# EAGLE board MOSFET_Board (EAGLE 9.3.0)
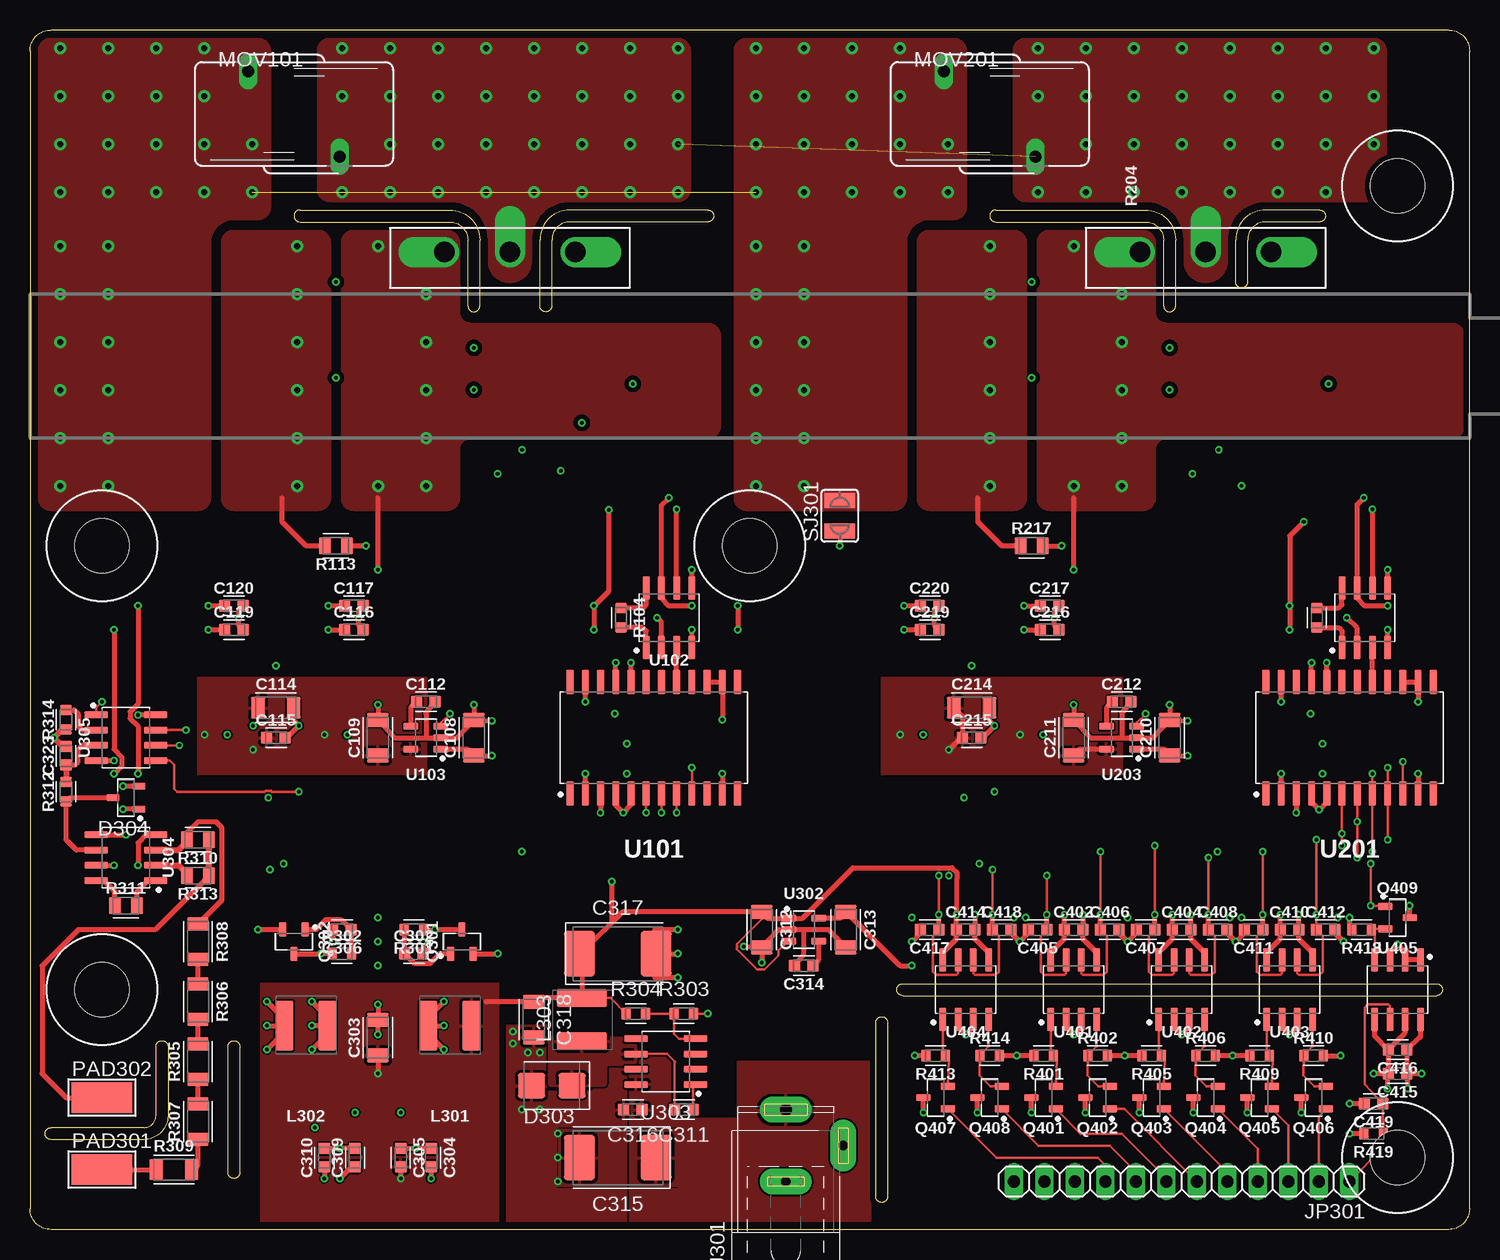
[diagram p4: board, top side]
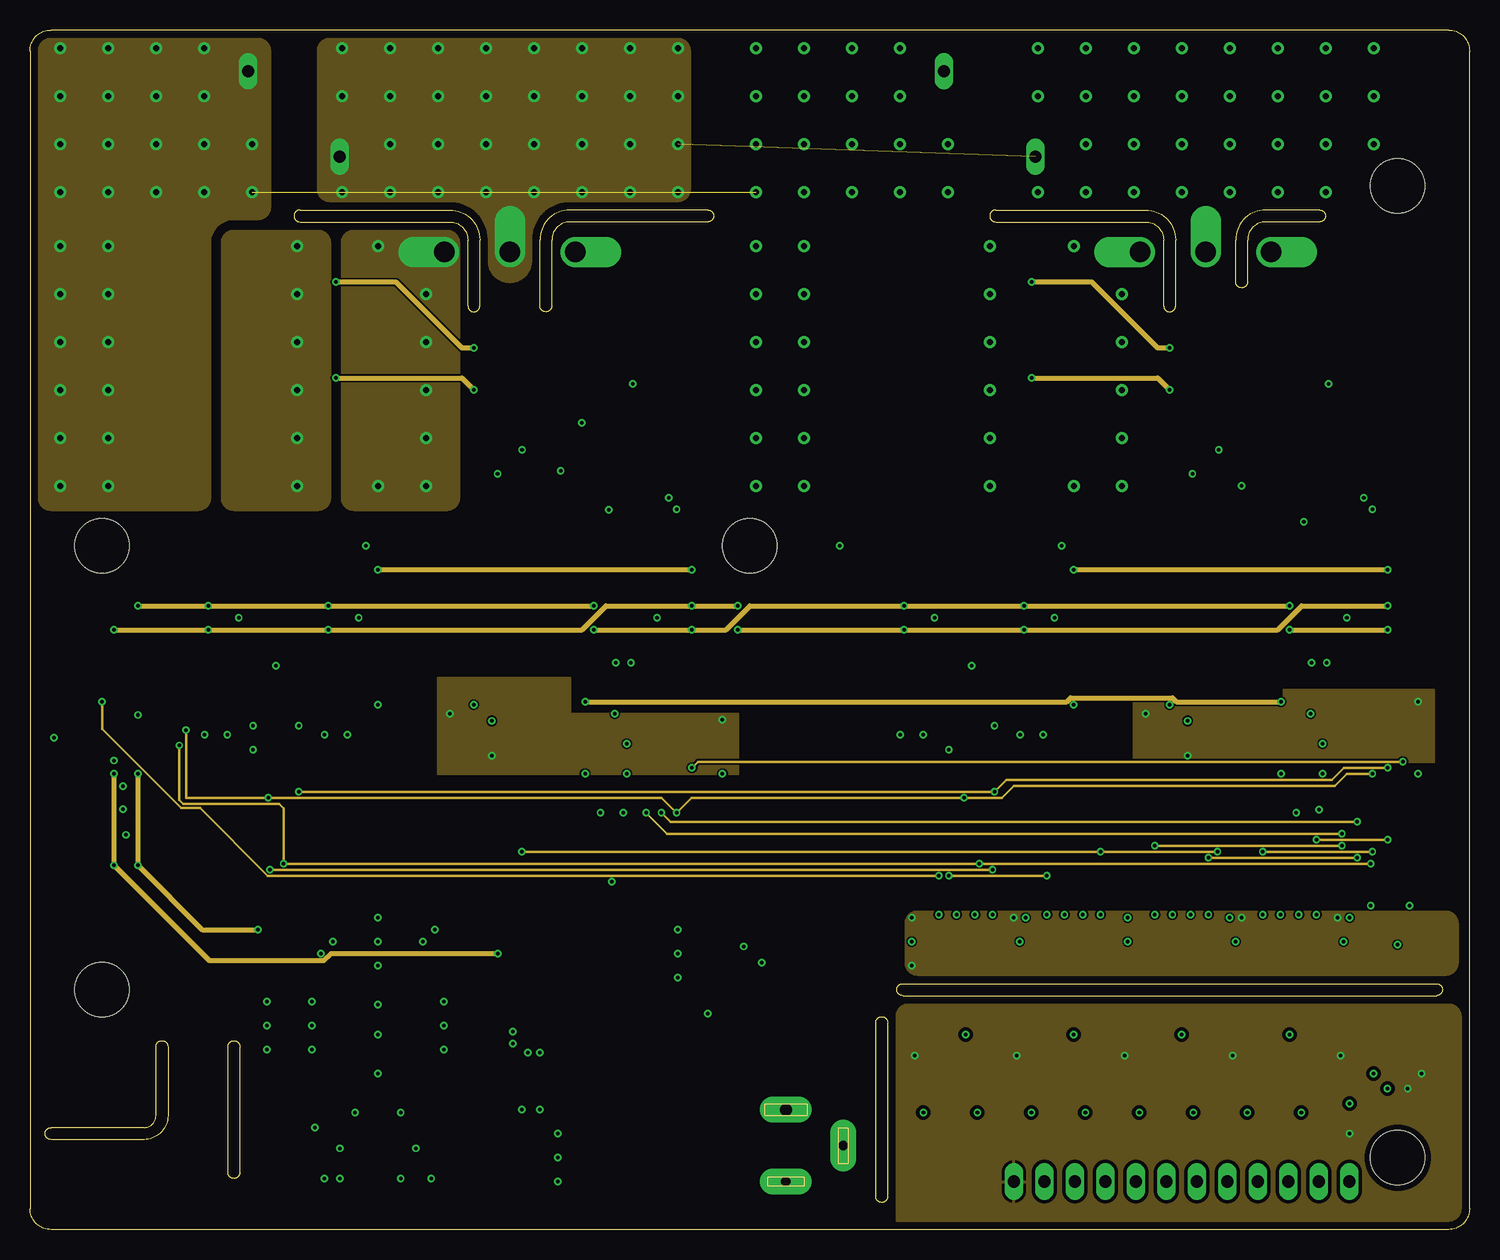
[diagram p5: board, inner layer Route2]
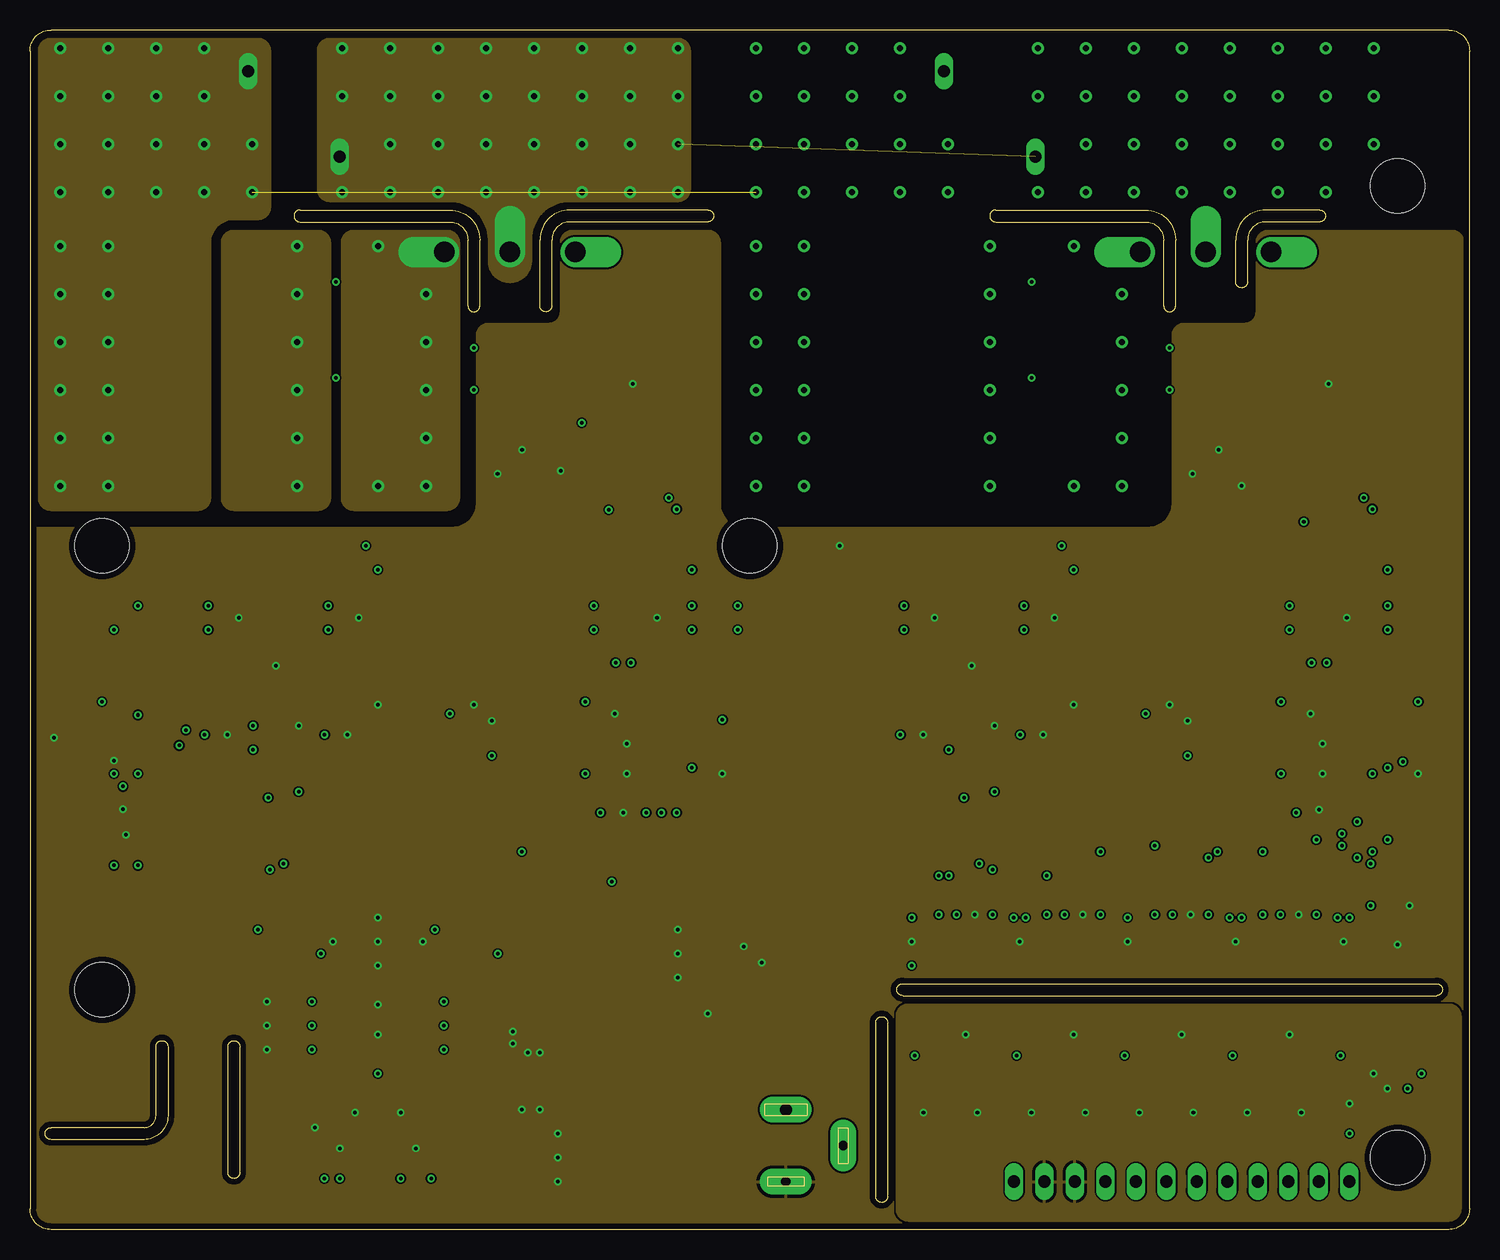
[diagram p6: board, inner layer Route15]
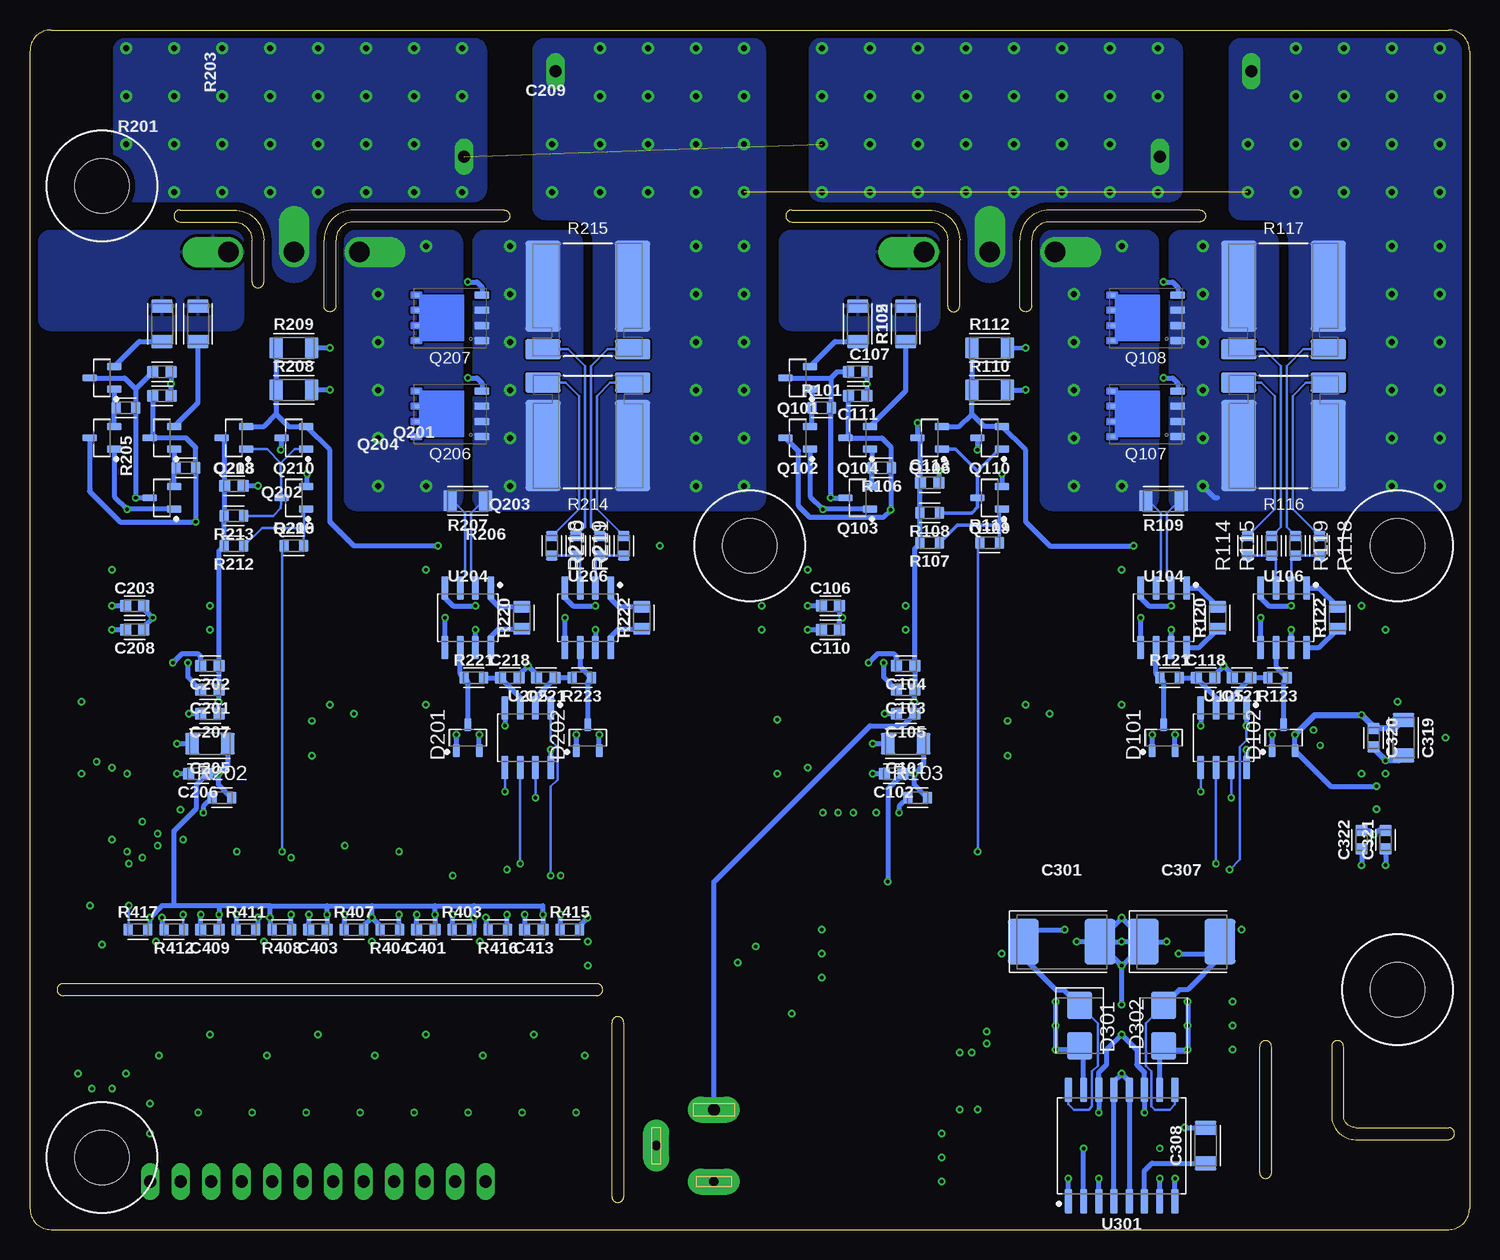
[diagram p7: board, bottom side, seen from below]

Size 120 x 100 mm. Coordinates in mm from the lower left corner, seen from the top.
Outline: 118.25,100 1.75,100 arc90 0,98.25 0,1.75 arc90 1.75,0 118.25,0 arc90 120,1.75 120,98.25 arc90 118.25,100
Outline: 72.75,20.5 117.25,20.5 arc-180 117.25,19.5 72.75,19.5 arc-180 72.75,20.5
Outline: 43.5,77 43.5,82.5 arc-90 45,84 56.5,84 arc180 56.5,85 45,85 arc90 42.5,82.5 42.5,77 arc180 43.5,77
Outline: 36.5,77 36.5,82.5 arc90 35,84 22.5,84 arc-180 22.5,85 35,85 arc-90 37.5,82.5 37.5,77 arc-180 36.5,77
Outline: 94.5,77 94.5,82.5 arc90 93,84 80.5,84 arc-180 80.5,85 93,85 arc-90 95.5,82.5 95.5,77 arc-180 94.5,77
Outline: 101.5,79 101.5,82.5 arc-90 103,84 107.5,84 arc180 107.5,85 103,85 arc90 100.5,82.5 100.5,79 arc180 101.5,79
Outline: 70.5,17.25 arc-180 71.5,17.25 71.5,2.75 arc-180 70.5,2.75 70.5,17.25
Outline: 1.75,7.5 arc-180 1.75,8.5 9.5,8.5 arc90 10.5,9.5 10.5,15.25 arc-90 11,15.75 arc-90 11.5,15.25 11.5,9.5 arc-90 9.5,7.5 1.75,7.5
Outline: 16.5,4.75 16.5,15.25 arc-180 17.5,15.25 17.5,4.75 arc-180 16.5,4.75
Copper layers (1+2*15+16): Top 0.035mm / dielectric 0.18mm / Route2 0.017mm / dielectric 1.12mm / Route15 0.017mm / dielectric 0.18mm / Bottom 0.035mm
Design rules "MOSFET_Board": minimum track width 6mil, minimum drill 0.3mm, track to track 6mil, track to pad 6mil, pad to pad 6mil, via to via 6mil, smd to smd 6mil, copper to edge 0.5mm, drill to drill 6mil, minimum pad ring 3mil, minimum via ring 3mil, stop-mask expansion 4mil, vias tented up to drill 0mil, thermal gap 10mil
Net classes: 0 default: drill 0.3 mm; 1 DUT+: drill 0.3 mm, clearance 1.905 mm to class 0; 2 DUT-: drill 0.3 mm, clearance 1.905 mm to class 1; 3 VSENSE+: drill 0.3 mm, clearance 1.905 mm to class 0, clearance 1.905 mm to class 2; 4 VSENSE-: drill 0.3 mm, clearance 1.905 mm to class 1, clearance 1.905 mm to class 3; 5 default_iso: drill 0.3 mm, clearance 1.905 mm to class 0, clearance 1.905 mm to class 1, clearance 1.905 mm to class 2, clearance 1.905 mm to class 3, clearance 1.905 mm to class 4

## Footprints (pad centres in the part's own frame; a part is rotated, then mirrored left to right if it is on the bottom)
CAPC3216X135 = smd 1.165 x 1.815: 1 -1.475,0; 2 1.475,0
CAPC1508X45 = smd 0.939 x 0.97: 1 -0.764,0; 2 0.764,0
CAPCP7343X310 = smd 2.6 x 3.8: 1 -3.2,0; 2 3.2,0
SOT95P230X110-3 = smd 1.059 x 0.59: 1 -1.078,0.95; 2 -1.078,-0.95; 3 1.078,0
DIOM4336X262 = smd 2.274 x 2.133: 1 -1.693,0; 2 1.693,0
SPC4078 = drill 0.8 pad 2.184 long: 1 -3,0; 2 0,-4.8 | drill 1 pad 2.184 long: 3 3,0
1X12 = drill 1.016 long: 1 -13.97,0; 2 -11.43,0; 3 -8.89,0; 4 -6.35,0; 5 -3.81,0; 6 -1.27,0; 7 1.27,0; 8 3.81,0; 9 6.35,0; 10 8.89,0; 11 11.43,0; 12 13.97,0
SRN5040 = smd 1.5 x 4.2: 1 -1.8,0; 2 1.8,0
S14K680 = drill 1.016 long: 1 -3.556,-3.81; 2 3.556,3.81
5-2,5 = smd 2.54 x 5.08: 1 0,0
SOT95P240X110-3 = smd 1.18 x 0.609: 1 -1.024,0.95; 2 -1.024,-0.95; 3 1.024,0
TO-264P-V = drill 1.7 pad 2.4 offset: 1 -5.46,0; 2 0,0; 3 5.46,0
POWERPAK-SO-8 = smd 1.27 x 0.61: 1 -2.67,1.905; 2 -2.67,0.635; 3 -2.67,-0.635; 4 -2.67,-1.905 | smd 0.6 x 0.3: 5 2.795,1.905; 6 2.795,0.635; 7 2.795,-0.635; 8 2.795,-1.905
RESC1608X70 = smd 0.799 x 0.974: 1 -0.815,0; 2 0.815,0
RESC3216X71 = smd 1.131 x 1.77: 1 -1.47,0; 2 1.47,0
RESC2012X65 = smd 1.031 x 1.42: 1 -0.919,0; 2 0.919,0
WSL3637_0.01 = smd 2.95 x 1.68: E1 -3.735,4.115; E2 3.735,4.115 | smd 2.95 x 7.62: I1 -3.735,-1.145; I2 3.735,-1.145
SJW = smd 1.27 x 2.54: 1 -1.27,0; 2 1.27,0
SOIC127P1032X265-24 = smd 2.052 x 0.602: 1 -4.654,6.985; 2 -4.654,5.715; 3 -4.654,4.445; 4 -4.654,3.175; 5 -4.654,1.905; 6 -4.654,0.635; 7 -4.654,-0.635; 8 -4.654,-1.905; 9 -4.654,-3.175; 10 -4.654,-4.445; 11 -4.654,-5.715; 12 -4.654,-6.985; 13 4.654,-6.985; 14 4.654,-5.715; 15 4.654,-4.445; 16 4.654,-3.175; 17 4.654,-1.905; 18 4.654,-0.635; 19 4.654,0.635; 20 4.654,1.905; 21 4.654,3.175; 22 4.654,4.445; 23 4.654,5.715; 24 4.654,6.985
SOIC127P599X175-8 = smd 1.97 x 0.585: 1 -2.471,1.905; 2 -2.471,0.635; 3 -2.471,-0.635; 4 -2.471,-1.905; 5 2.471,-1.905; 6 2.471,-0.635; 7 2.471,0.635; 8 2.471,1.905
SOT95P280X145-5 = smd 1.209 x 0.589: 1 -1.253,0.95; 2 -1.253,0; 3 -1.253,-0.95; 4 1.253,-0.95; 5 1.253,0.95
SOIC127P1032X265-16 = smd 2.052 x 0.602: 1 -4.654,4.445; 2 -4.654,3.175; 3 -4.654,1.905; 4 -4.654,0.635; 5 -4.654,-0.635; 6 -4.654,-1.905; 7 -4.654,-3.175; 8 -4.654,-4.445; 9 4.654,-4.445; 10 4.654,-3.175; 11 4.654,-1.905; 12 4.654,-0.635; 13 4.654,0.635; 14 4.654,1.905; 15 4.654,3.175; 16 4.654,4.445
M4 = hole 4.5: 0,0

## Placement (x,y rotation side)
C101  4µ7  [CAPC3216X135]  47,40.5 180 bottom
C102  100n  [CAPC1508X45]  48,38 180 bottom
C103  10n  [CAPC1508X45]  47,45 180 bottom
C104  10n  [CAPC1508X45]  47,47 180 bottom
C105  100n  [CAPC1508X45]  47,43 180 bottom
C106  100n  [CAPC1508X45]  53.27,52 0 bottom
C107  470n  [CAPC1508X45]  51,71.5 0 bottom
C108  4µ7  [CAPC3216X135]  37,41 90 top
C109  4µ7  [CAPC3216X135]  29,41 90 top
C110  100n  [CAPC1508X45]  53.27,50 180 bottom
C111  470n  [CAPC1508X45]  51,69.5 180 bottom
C112  10n  [CAPC1508X45]  33,44 0 top
C113  100n  [CAPC1508X45]  45,62.25 0 bottom
C114  4µ7  [CAPC3216X135]  20.5,43.5 0 top
C115  100n  [CAPC1508X45]  20.5,41 0 top
C116  100n  [CAPC1508X45]  27,50 0 top
C117  100n  [CAPC1508X45]  27,52 0 top
C118  470p  [CAPC1508X45]  22,46 0 bottom
C119  100n  [CAPC1508X45]  17,50 0 top
C120  100n  [CAPC1508X45]  17,52 0 top
C121  470p  [CAPC1508X45]  19,46 180 bottom
C201  10n  [CAPC1508X45]  105,45 180 bottom
C202  10n  [CAPC1508X45]  105,47 180 bottom
C203  100n  [CAPC1508X45]  111.27,52 0 bottom
C204  470n  [CAPC1508X45]  109,71.5 0 bottom
C205  4µ7  [CAPC3216X135]  105,40.5 180 bottom
C206  100n  [CAPC1508X45]  106,38 180 bottom
C207  100n  [CAPC1508X45]  105,43 180 bottom
C208  100n  [CAPC1508X45]  111.27,50 180 bottom
C209  470n  [CAPC1508X45]  109,69.5 180 bottom
C210  4µ7  [CAPC3216X135]  95,41 90 top
C211  4µ7  [CAPC3216X135]  87,41 90 top
C212  10n  [CAPC1508X45]  91,44 0 top
C213  100n  [CAPC1508X45]  103,62 0 bottom
C214  4µ7  [CAPC3216X135]  78.5,43.5 0 top
C215  100n  [CAPC1508X45]  78.5,41 0 top
C216  100n  [CAPC1508X45]  85,50 0 top
C217  100n  [CAPC1508X45]  85,52 0 top
C218  470p  [CAPC1508X45]  80,46 0 bottom
C219  100n  [CAPC1508X45]  75,50 0 top
C220  100n  [CAPC1508X45]  75,52 0 top
C221  470p  [CAPC1508X45]  77,46 180 bottom
C301  15µ 25V  [CAPCP7343X310]  34,24 0 bottom
C302  470n  [CAPC1508X45]  32,23 0 top
C303  4µ7  [CAPC3216X135]  29,16 90 top
C304  10n  [CAPC1508X45]  33.45,6 270 top
C305  100n  [CAPC1508X45]  30.91,6 270 top
C306  470n  [CAPC1508X45]  26,25 180 top
C307  15µ 25V  [CAPCP7343X310]  24,24 0 bottom
C308  4µ7  [CAPC3216X135]  22,7 90 bottom
C309  470n  [CAPC1508X45]  27.09,6 90 top
C310  10n  [CAPC1508X45]  24.55,6 90 top
C311  10n  [CAPC1508X45]  54.5,10 180 top
C312  4µ7  [CAPC3216X135]  61,25 270 top
C313  4µ7  [CAPC3216X135]  68,25 270 top
C314  10n  [CAPC1508X45]  64.5,22 180 top
C315  15µ 25V  [CAPCP7343X310]  49,6 180 top
C316  100n  [CAPC1508X45]  50.25,10 180 top
C317  100µ 10V  [CAPCP7343X310]  49,23 0 top
C318  4µ7  [CAPC3216X135]  42,17.5 270 top
C319  4µ7  [CAPC3216X135]  5.5,41 270 bottom
C320  100n  [CAPC1508X45]  8,41 270 bottom
C321  100n  [CAPC1508X45]  7,32.5 90 bottom
C322  100n  [CAPC1508X45]  9,32.5 90 bottom
C323  470p  [CAPC1508X45]  3,39.5 90 top
C401  100n  [CAPC1508X45]  87,25 180 bottom
C402  10n  [CAPC1508X45]  87,25 0 top
C403  100n  [CAPC1508X45]  96,25 180 bottom
C404  10n  [CAPC1508X45]  96,25 0 top
C405  15p  [CAPC1508X45]  84,25 180 top
C406  15p  [CAPC1508X45]  90,25 0 top
C407  15p  [CAPC1508X45]  93,25 180 top
C408  15p  [CAPC1508X45]  99,25 0 top
C409  100n  [CAPC1508X45]  105,25 180 bottom
C410  10n  [CAPC1508X45]  105,25 0 top
C411  15p  [CAPC1508X45]  102,25 180 top
C412  15p  [CAPC1508X45]  108,25 0 top
C413  100n  [CAPC1508X45]  78,25 180 bottom
C414  10n  [CAPC1508X45]  78,25 0 top
C415  100n  [CAPC1508X45]  114,13 180 top
C416  10n  [CAPC1508X45]  114,15 180 top
C417  15p  [CAPC1508X45]  75,25 180 top
C418  15p  [CAPC1508X45]  81,25 0 top
C419  15p  [CAPC1508X45]  112,10.5 180 top
D101  BAT54S  [SOT95P230X110-3]  25.5,41 90 bottom
D102  BAT54S  [SOT95P230X110-3]  15.5,41 90 bottom
D201  BAT54S  [SOT95P230X110-3]  83.5,41 90 bottom
D202  BAT54S  [SOT95P230X110-3]  73.5,41 90 bottom
D301  SK12  [DIOM4336X262]  32.5,17 270 bottom
D302  SK12  [DIOM4336X262]  25.5,17 90 bottom
D303  SK12  [DIOM4336X262]  43.5,12 180 top
D304  BAT54S  [SOT95P230X110-3]  8,36 180 top
J301  [SPC4078]  63,7 90 top
JP301  [1X12]  96,4 180 top
L301  100µ  [SRN5040]  35,17 180 top
L302  100µ  [SRN5040]  23,17 180 top
L303  47µ  [SRN5040]  46,17.5 90 top
MOV101  680V  [S14K680]  22,93 270 top
MOV201  [S14K680]  80,93 270 top
PAD301  WIREPADSMD5-2,5  [5-2,5]  6,5 270 top
PAD302  WIREPADSMD5-2,5  [5-2,5]  6,11 270 top
Q101  BC817  [SOT95P240X110-3]  56,71 180 bottom
Q102  BC807  [SOT95P240X110-3]  56,66 180 bottom
Q103  BC817  [SOT95P240X110-3]  51,61 180 bottom
Q104  BC807  [SOT95P240X110-3]  51,66 180 bottom
Q105  IXTK102N65X2  [TO-264P-V]  40,81.5 180 top
Q106  BC817  [SOT95P240X110-3]  45,66 180 bottom
Q107  SIRC10DP  [POWERPAK-SO-8]  27,68 180 bottom
Q108  SIRC10DP  [POWERPAK-SO-8]  27,76 180 bottom
Q109  BC817  [SOT95P240X110-3]  40,61 180 bottom
Q110  BC807  [SOT95P240X110-3]  40,66 180 bottom
Q201  BC817  [SOT95P240X110-3]  114,71 180 bottom
Q202  BC807  [SOT95P240X110-3]  114,66 180 bottom
Q203  BC817  [SOT95P240X110-3]  109,61 180 bottom
Q204  BC807  [SOT95P240X110-3]  109,66 180 bottom
Q205  IXTK102N65X2  [TO-264P-V]  98,81.5 180 top
Q206  SIRC10DP  [POWERPAK-SO-8]  85,68 180 bottom
Q207  SIRC10DP  [POWERPAK-SO-8]  85,76 180 bottom
Q208  BC817  [SOT95P240X110-3]  103,66 180 bottom
Q209  BC817  [SOT95P240X110-3]  98,61 180 bottom
Q210  BC807  [SOT95P240X110-3]  98,66 180 bottom
Q301  BC817  [SOT95P240X110-3]  36,24 90 top
Q302  BC817  [SOT95P240X110-3]  22,24 270 top
Q401  BC807  [SOT95P240X110-3]  84.5,11 180 top
Q402  BC807  [SOT95P240X110-3]  89,11 180 top
Q403  BC807  [SOT95P240X110-3]  93.5,11 180 top
Q404  BC807  [SOT95P240X110-3]  98,11 180 top
Q405  BC807  [SOT95P240X110-3]  102.5,11 180 top
Q406  BC807  [SOT95P240X110-3]  107,11 180 top
Q407  BC807  [SOT95P240X110-3]  75.5,11 180 top
Q408  BC807  [SOT95P240X110-3]  80,11 180 top
Q409  BC807  [SOT95P240X110-3]  114,26 0 top
R101  5k  [RESC1608X70]  54,68.5 0 bottom
R102  2R  [RESC3216X71]  51,75.5 270 bottom
R103  5k  [RESC1608X70]  46,36 0 bottom
R104  49k3  [RESC1608X70]  49.27,51 270 top
R105  2R  [RESC3216X71]  47,75.5 90 bottom
R106  5k  [RESC1608X70]  49,63.5 180 bottom
R107  100k  [RESC1608X70]  45,57.25 180 bottom
R108  1k  [RESC1608X70]  45,59.75 180 bottom
R109  2R  [RESC3216X71]  25.5,60.75 180 bottom
R110  2R  [RESC3216X71]  40,70 0 bottom
R111  1k  [RESC1608X70]  40,57.25 0 bottom
R112  2R  [RESC3216X71]  40,73.5 0 bottom
R113  2k15  [RESC2012X65]  25.5,57 180 top
R114  5k  [RESC1608X70]  18.5,57 90 bottom
R115  5k  [RESC1608X70]  16.5,57 90 bottom
R116  0R003  [WSL3637_0.01]  15.5,66.5 0 bottom
R117  0R003  [WSL3637_0.01]  15.5,77.5 180 bottom
R118  5k  [RESC1608X70]  12.5,57 270 bottom
R119  5k  [RESC1608X70]  14.5,57 270 bottom
R120  2k15  [RESC2012X65]  21,51 90 bottom
R121  100R  [RESC1608X70]  25,46 0 bottom
R122  2k15  [RESC2012X65]  11,51 90 bottom
R123  100R  [RESC1608X70]  16,46 180 bottom
R201  5k  [RESC1608X70]  112,68.5 0 bottom
R202  5k  [RESC1608X70]  104,36 0 bottom
R203  2R  [RESC3216X71]  109,75.5 270 bottom
R204  49k3  [RESC1608X70]  107.27,51 270 top
R205  2R  [RESC3216X71]  106,75.5 90 bottom
R206  5k  [RESC1608X70]  107,63.5 180 bottom
R207  2R  [RESC3216X71]  83.5,60.75 180 bottom
R208  2R  [RESC3216X71]  98,70 0 bottom
R209  2R  [RESC3216X71]  98,73.5 0 bottom
R210  5k  [RESC1608X70]  76.5,57 270 bottom
R211  5k  [RESC1608X70]  74.5,57 270 bottom
R212  100k  [RESC1608X70]  103,57 180 bottom
R213  1k  [RESC1608X70]  103,59.5 180 bottom
R214  0R003  [WSL3637_0.01]  73.5,66.5 0 bottom
R215  0R003  [WSL3637_0.01]  73.5,77.5 180 bottom
R216  1k  [RESC1608X70]  98,57 0 bottom
R217  2k15  [RESC2012X65]  83.5,57 0 top
R218  5k  [RESC1608X70]  72.5,57 90 bottom
R219  5k  [RESC1608X70]  70.5,57 90 bottom
R220  2k15  [RESC2012X65]  79,51 90 bottom
R221  100R  [RESC1608X70]  83,46 0 bottom
R222  2k15  [RESC2012X65]  69,51 90 bottom
R223  100R  [RESC1608X70]  74,46 180 bottom
R301  350R  [RESC1608X70]  32,25 180 top
R302  350R  [RESC1608X70]  26,23 0 top
R303  10k  [RESC1608X70]  54.5,18 0 top
R304  10k  [RESC1608X70]  50.5,18 0 top
R305  2M  [RESC3216X71]  14,14 90 top
R306  2M  [RESC3216X71]  14,19 270 top
R307  2M  [RESC3216X71]  14,9 90 top
R308  2M  [RESC3216X71]  14,24 270 top
R309  2M  [RESC3216X71]  12,5 0 top
R310  2k15  [RESC2012X65]  14,32.5 180 top
R311  2k15  [RESC2012X65]  8,27 0 top
R312  100R  [RESC1608X70]  3,36.5 90 top
R313  2k15  [RESC2012X65]  14,29.5 180 top
R314  10k  [RESC1608X70]  3,42.5 90 top
R401  350R  [RESC1608X70]  84.5,14.5 180 top
R402  350R  [RESC1608X70]  89,14.5 0 top
R403  350R  [RESC1608X70]  84,25 0 bottom
R404  350R  [RESC1608X70]  90,25 180 bottom
R405  350R  [RESC1608X70]  93.5,14.5 180 top
R406  350R  [RESC1608X70]  98,14.5 0 top
R407  350R  [RESC1608X70]  93,25 0 bottom
R408  350R  [RESC1608X70]  99,25 180 bottom
R409  350R  [RESC1608X70]  102.5,14.5 180 top
R410  350R  [RESC1608X70]  107,14.5 0 top
R411  1k  [RESC1608X70]  102,25 0 bottom
R412  1k  [RESC1608X70]  108,25 180 bottom
R413  350R  [RESC1608X70]  75.5,14.5 180 top
R414  350R  [RESC1608X70]  80,14.5 0 top
R415  1k  [RESC1608X70]  75,25 0 bottom
R416  1k  [RESC1608X70]  81,25 180 bottom
R417  1k  [RESC1608X70]  111,25 0 bottom
R418  350R  [RESC1608X70]  111,25 180 top
R419  350R  [RESC1608X70]  112,8 180 top
SJ301  DUT_GND  [SJW]  67.5,59.5 90 top
U101  AD420  [SOIC127P1032X265-24]  52,41 90 top
U102  AD620  [SOIC127P599X175-8]  53.27,51 90 top
U103  LP2985  [SOT95P280X145-5]  33,41 180 top
U104  AD620  [SOIC127P599X175-8]  25.5,51 270 bottom
U105  LTC1865_S8  [SOIC127P599X175-8]  20.5,41 270 bottom
U106  AD620  [SOIC127P599X175-8]  15.5,51 270 bottom
U201  AD420  [SOIC127P1032X265-24]  110,41 90 top
U202  AD620  [SOIC127P599X175-8]  111.27,51 90 top
U203  LP2985  [SOT95P280X145-5]  91,41 180 top
U204  AD620  [SOIC127P599X175-8]  83.5,51 270 bottom
U205  LTC1865_S8  [SOIC127P599X175-8]  78.5,41 270 bottom
U206  AD620  [SOIC127P599X175-8]  73.5,51 270 bottom
U301  MAX743  [SOIC127P1032X265-16]  29,7 90 bottom
U302  LP2985  [SOT95P280X145-5]  64.5,25 0 top
U303  LM2671M  [SOIC127P599X175-8]  53,14 180 top
U304  AD620  [SOIC127P599X175-8]  8,31 180 top
U305  LTC1865_S8  [SOIC127P599X175-8]  8,41 0 top
U401  HCPL-063N  [SOIC127P599X175-8]  87,20 90 top
U402  HCPL-063N  [SOIC127P599X175-8]  96,20 90 top
U403  HCPL-063N  [SOIC127P599X175-8]  105,20 90 top
U404  HCPL-063N  [SOIC127P599X175-8]  78,20 90 top
U405  HCPL-063N  [SOIC127P599X175-8]  114,20 270 top
U$1  [M4]  114,6 0 top
U$2  [M4]  60,57 0 top
U$3  [M4]  6,20 0 top
U$4  [M4]  6,57 0 top
U$5  [M4]  114,87 0 top

## Tracks (layer width: path | path; a pad name or v marks a point on that pad's centre or on a via)
+3V3  (via drill 0.3 pad 0.6)
  Top 0.406: U302.5 67.55,25.95 C313.1 72.53,22 v73.5,22
  Bottom 0.406: R415.2 74.19,25.33 v73.51,26 | v82,26 82,25.19 R416.2 | R411.2 101,25.19 v101,26 | v109,26 109,25.19 R412.2
  pour Route2: 74,21.25 arc-90 73,22.25 73,25.5 arc-90 74,26.5 118,26.5 arc-90 119,25.5 119,22.25 arc-90 118,21.25
+3V_1  (via drill 0.3 pad 0.6)
  Top 0.406: D304.2 v7.75,36.95 | U305.8 9.01,42.91 v9,42.89
  Bottom 0.406: v18.59,40 U105.8 | D101.2 v24.55,41.25 | D102.2 14.56,39.92 | D102.2 v14.55,41.25 | D102.2 11.58,36.95 v7.75,36.95
  Bottom 0.508: v14.55,41.25 12.9,42.89 v9,42.89 8,41.89 C320.1 6.21,41.76 C319.1
  pour Top: 14,38 33,38 33,46 14,46
+3V_2  (via drill 0.3 pad 0.6)
  Top 0.406: U203.5 87.45,40.05 C211.1 | v76.59,40 77.59,41 C215.1 77.74,42.79 C214.1
  Bottom 0.406: v76.59,40 U205.8 | D201.2 v82.55,41.25 | D202.2 v72.55,41.25
  pour Top: 71,38 91,38 91,46 71,46
+5V  (via drill 0.3 pad 0.6)
  Top 0.203: U302.3 62.4,23.25 62.4,22.87 61.23,21.7 60.62,21.7 58.95,23.37 58.95,23.83 61,25.88 C312.1 | R304.1 48.38,19.3 L303.2
  Top 0.406: v46.28,38 U101.2 | v104.28,38 U201.2 | U404.8 76.09,23.09 77.24,24.24 C413.1 v77.24,26.25 77.24,29.21 77.25,29.23 77.25,29.77 76.87,30.16 68.59,30.16 64.39,25.95 U302.1 61.45,25.95 C312.1 49.38,26.48 48.5,25.6 | U401.8 85.09,23.09 86.24,24.24 C402.1 v86.24,26.25 | U402.8 94.09,23.09 95.24,24.24 C404.1 v95.24,26.25 | U403.8 103.09,23.09 104.24,24.24 C410.1 v104.24,26.25 | R417.2 110,25.19 v110,26 | C305.2 v30.91,4.25 | C303.1 v29,13 | 48.5,25.6 C317.1 46,22.9 L303.2 42.33,19.3 C318.1 38.02,18.98 38,19 | 48.5,25.6 v48.5,29
  Bottom 0.406: v46.28,38 C102.1 48.5,36.74 v48.5,29 | 100,27 95.24,27 | 95.24,27 91.5,27 | 91.5,27 86.24,27 | 86.24,27 83,27 | 83,27 77.24,27 v77.24,26.25 C413.1 | 86.24,27 v86.24,26.25 C402.1 | 95.24,27 v95.24,26.25 C404.1 | C410.1 v104.24,26.25 104.24,26.99 | R403.2 83,25.19 v83,26 83,27 | v91.5,26 90.81,25.31 R404.2 | v91.5,26 92.19,25.31 R407.2 | R408.2 100,25.19 v100,26 100,27 | v91.5,26 91.5,27 | 100,27 104.22,27 104.24,26.99 | 104.24,26.99 108,26.99 | 108,26.99 109.01,26.99 v110,26 110,25.19 R417.2 | R202.2 104.28,37.1 v104.28,38 | R103.2 46.28,37.1 v46.28,38 | U301.3 v30.91,4.25 | C101.1 45.52,38.76 v46.28,38 | v104.28,38 C206.1 106.12,37.12 106.12,35.12 108,33.23 108,26.99 | C205.1 103.53,38.76 v104.28,38 | U301.5 U301.12 28.37,12.37 v29,13 29.63,12.37 U301.13 U301.4
  pour Top: 39,0.75 19.25,0.75 19.25,20.5 39,20.5
+5V_I  (via drill 0.3 pad 0.6)
  Top 0.406: R410.2 v109.25,14.5 | R409.2 v100.25,14.5 R406.2 | R405.2 v91.25,14.5 R402.2 | R401.2 v82.25,14.5 R414.2 | R413.2 v73.75,14.5 | U405.8 115.91,16.05 C416.1 C415.1 | v116,13 C415.1 | C415.1 v114.85,11.75 | R419.2 v110,8
  pour Route2 (isolate 0.305): 72.25,0.75 72.25,17.75 arc-90 73.25,18.75 118.25,18.75 arc-90 119.25,17.75 119.25,1.75 arc-90 118.25,0.75
+12V  (via drill 0.3 pad 0.6)
  Top 0.406: U201.23 v104.28,44 | U101.23 v46.28,44
  Route2 0.406: v46.28,44 86.43,44 86.76,44.33 95.24,44.33 95.57,44 v104.28,44
  Bottom 0.406: C213.1 103.81,61.95 | 103.81,61.95 R213.2 R212.2 104.24,56.58 C202.1 104.28,46.95 104.28,44.95 | Q208.3 103.81,65.79 103.81,61.95 | C207.1 104.28,43.05 v104.28,44 104.28,44.95 | C201.1 104.28,44.95 | J301.3 63,29 50,42 47.24,42 C105.1 46.28,43.05 v46.28,44 46.28,44.95 C103.1 C104.1 46.24,56.76 45.78,57.22 R107.2 R108.2 45.81,62.2 C113.1 45.76,65.76 46.01,66.01 | v46,67.25 46,66.03 46.01,66.01 | Q106.3 46.01,66.01
  pour Top (rank 2): 53.5,9.25 53.5,14.5 50,14.5 50,0.75 70,0.75 70,14 59,14 59,9.25
+15V  (via drill 0.3 pad 0.6)
  Top 0.406: v55.17,52 53.27,52 52.63,52.64 U102.7 52.63,60.39 v53.25,61 | C119.1 v14.87,50 | v24.87,50 C116.1 | v59,52 v59,50 | C219.1 v72.87,50 | v82.86,50 C216.1 | v113.17,52 111.27,52 110.64,52.64 U202.7 110.64,60.45 v111.19,61 | U304.7 v7,30.37 | v7,50 7,40.02 7.66,39.37 7.66,38.66 v7,38 | Q301.2 36.97,23 v39,23
  Route2 0.406: v59,52 v55.17,52 48,52 46,50 v24.87,50 v14.87,50 v7,50 | v59,50 v72.87,50 v82.86,50 104,50 106,52 v113.17,52 | v7,38 v7,30.37 14.95,22.42 24.49,22.42 25.07,23 v39,23
  Bottom 0.406: C106.1 v55.17,52 | U106.7 v14.87,50 | U104.7 v24.87,50 | Q103.3 v53.25,61 53.25,68.44 | v72.87,50 U206.7 | 53.25,68.44 R101.2 | Q101.3 53.25,71 | 53.25,71 53.25,68.44 | C107.1 52.75,71.5 53.25,71 | U204.7 v82.86,50 | C204.1 111.19,70.08 | 111.19,70.08 R201.2 v111.19,61 Q203.3 | Q201.3 112.11,71 111.19,70.08 | C203.1 v113.17,52 | C321.1 v7,30.37
-15V  (via drill 0.3 pad 0.6)
  Top 0.406: C120.1 v14.87,52 | C117.1 v24.87,52 | v47,50 v47,52 48.25,53.25 v48.25,60 | C220.1 v72.87,52 | v82.86,52 C217.1 | U202.4 v113.17,50 | U102.4 v55.17,50 | v105,50 v105,52 105,57.81 v106.19,59 | U304.4 9.66,32.91 9,32.25 v9,30.37 | v9,52 9,43.82 8.34,43.17 8.34,42.62 9,41.97 v9,38 | Q302.2 21.03,25 v19,25
  Route2 0.406: v47,52 v24.87,52 v14.87,52 v9,52 | v47,50 v55.17,50 58,50 60,52 v72.87,52 v82.86,52 v105,52 | v105,50 v113.17,50 | v9,38 v9,30.37 14.37,25 v19,25
  Bottom 0.406: Q102.3 55.92,64.9 55.92,60.29 55.02,59.39 48.86,59.39 v48.25,60 48.25,63.44 | C110.2 v55.17,50 | v14.87,52 16.75,52 17.41,52.66 U106.4 | U104.4 27.41,52.66 26.75,52 v24.87,52 | U206.4 75.41,52.66 74.75,52 v72.87,52 | R106.1 48.25,63.44 | 48.25,63.44 48.25,65.25 49,66 Q104.3 51.76,66.26 C111.2 | U204.4 85.41,52.66 84.75,52 v82.86,52 | C209.2 109.76,66.26 Q204.3 107,66 106.19,65.19 R206.1 v106.19,59 112.5,59 115.03,61.53 Q202.3 | C208.2 v113.17,50 | C322.1 v9,30.37
BPY1G1  (via drill 0.3 pad 0.6)
  Route2 0.406: v25.5,71 36,71 v37,70
  Bottom 0.406: v25.5,71 24.75,71 24.33,70.58 Q107.4 | R110.2 v37,70
BYP  (via drill 0.3 pad 0.6)
  Top 0.203: U401.6 87.64,21.37 87.75,21.25 89.5,21.25 89.75,21.5 89.75,24.49 C406.1 | v89.24,26.25 v89.24,31.5
  Top 0.406: C406.1 v89.24,26.25
  Route2 0.203: v98.99,31.5 v89.24,31.5 v41,31.5
  Bottom 0.203: v98.99,31.5 98.99,56.83 R216.1 | v41,31.5 41,57.06 R111.1
  Bottom 0.406: R404.1 89.24,25.05 v89.24,26.25
BYP1  (via drill 0.3 pad 0.6)
  Top 0.406: v28,57 R113.1
  Bottom 0.406: R112.1 R110.1 41.5,68 | 41.5,68 40.45,66.95 Q110.2 37,64.97 37,59 35,57 v28,57 | Q106.2 42.55,66.95 41.5,68
BYP1G2  (via drill 0.3 pad 0.6)
  Route2 0.406: v37,73.5 36,73.5 30.5,79 v25.5,79
  Bottom 0.406: R112.2 38.5,73.5 v37,73.5 | v25.5,79 24.75,79 24.33,78.58 Q108.4
BYP2  (via drill 0.3 pad 0.6)
  Top 0.406: R217.2 v86,57
  Bottom 0.406: R209.1 R208.1 99.47,67.97 | 99.47,67.97 98.45,66.95 Q210.2 95,64.97 95,59 93,57 v86,57 | Q208.2 100.49,66.95 99.47,67.97
BYP2G1  (via drill 0.3 pad 0.6)
  Route2 0.406: v83.5,71 94,71 v95,70
  Bottom 0.406: v95,70 R208.2 | v83.5,71 82.75,71 82.33,70.58 Q206.4
BYP2G2  (via drill 0.3 pad 0.6)
  Route2 0.406: v95,73.5 94,73.5 88.5,79 v83.5,79
  Bottom 0.406: v95,73.5 R209.2 | v83.5,79 82.75,79 82.33,78.58 Q207.4
BYP_I
  Top 0.203: JP301.6 91.22,10.05 Q402.1
CLR_DAC  (via drill 0.3 pad 0.6)
  Top 0.203: U402.7 95.36,21.37 95.25,21.25 93.5,21.25 93.25,21.5 93.25,24.49 C407.1 | U201.6 v109.36,33 v109.36,32 | U101.6 v51.37,34.75 | v93.76,26.25 v93.76,32
  Top 0.406: C407.1 v93.76,26.25
  Route2 0.203: v51.37,34.75 53.12,33 v109.36,33 | v109.36,32 v93.76,32
  Bottom 0.406: R407.1 93.76,25.05 v93.76,26.25
CLR_DAC_I
  Top 0.203: JP301.5 99.81,4.77 Q403.1
CONV_C1  (via drill 0.3 pad 0.6)
  Top 0.203: U404.6 78.63,21.37 78.75,21.25 80.5,21.25 80.75,21.5 80.75,24.49 C418.1 | v80.24,30 v80.24,26.25
  Top 0.406: C418.1 v80.24,26.25
  Route2 0.203: v20,30 v80.24,30
  Bottom 0.203: v18.59,42 18.59,40.78 19.15,40.23 19.15,39.77 19.14,39.76 19.14,30.86 v20,30
  Bottom 0.406: R416.1 80.24,25.05 v80.24,26.25 | U105.1 v18.59,42
CONV_C1_I
  Top 0.203: JP301.8 92.19,4.81 90,7 84.08,7 Q408.1
CONV_C2  (via drill 0.3 pad 0.6)
  Top 0.203: U401.7 86.36,21.37 86.25,21.25 84.5,21.25 84.25,21.5 84.25,24.49 C405.1 | v84.76,26.25 v84.76,29.5
  Top 0.406: C405.1 v84.76,26.25
  Route2 0.203: v84.76,29.5 v76.59,29.5
  Bottom 0.203: U205.1 76.59,40.78 76.04,40.23 76.04,37.48 76.59,36.93 v76.59,29.5
  Bottom 0.406: R403.1 84.76,25.05 v84.76,26.25
CONV_C2_I
  Top 0.203: JP301.7 94.73,4.27 91,8 87.58,8 Q401.1
CONV_V  (via drill 0.3 pad 0.6)
  Top 0.203: U404.7 77.37,21.37 77.25,21.25 75.5,21.25 75.25,21.5 75.25,24.49 C417.1 | v75.76,26.25 v75.76,29.5 | U305.1 5.53,43.53 v6,44
  Top 0.406: C417.1 v75.76,26.25
  Route2 0.203: v75.76,29.5 19.82,29.5 14.18,35.14 12.6,35.14 6,41.75 v6,44
  Bottom 0.406: R415.1 75.76,25.05 v75.76,26.25
CONV_V_I
  Top 0.203: JP301.9 89.65,5.35 89,6 80.58,6 Q407.1
CSEN_H1  (via drill 0.5 pad 1)
  Top 0.406: R113.2 23,57 21,59 21,61
  Bottom 0.203: R109.1 24.25,60.75 25.25,59.75 25.25,54.5 24.88,54.12 U104.2
  Bottom 0.406: 21,61 21.25,61 v22.25,62
  other vias: 22.25,82 22.25,78 22.25,74 22.25,70 22.25,66
  pour Bottom (no thermals): 25,82.25 arc90 24,83.25 17,83.25 arc90 16,82.25 16,61 arc90 17,60 24,60 arc90 25,61
  pour Top (isolate 0.4): 16,82.25 arc-90 17,83.25 24,83.25 arc-90 25,82.25 25,61 arc-90 24,60 17,60 arc-90 16,61
  pour Top (isolate 0.4, no thermals): 16,82.25 arc-90 17,83.25 24,83.25 arc-90 25,82.25 25,61 arc-90 24,60 17,60 arc-90 16,61
  pour Route2 (no thermals): 16,82.25 arc-90 17,83.25 24,83.25 arc-90 25,82.25 25,61 arc-90 24,60 17,60 arc-90 16,61
  pour Route15 (no thermals): 16,82.25 arc-90 17,83.25 24,83.25 arc-90 25,82.25 25,61 arc-90 24,60 17,60 arc-90 16,61
CSEN_H2  (via drill 0.5 pad 1)
  Top 0.406: R217.1 81,57 79,59 79,61
  Bottom 0.203: R207.1 82.25,60.5 82.5,60.5 83.25,59.75 83.25,54.5 82.86,54.11 U204.2
  other vias: 80,82 80,78 80,74 80,70 80,66 80,62
  pour Top (no thermals): 74,82.25 arc-90 75,83.25 82,83.25 arc-90 83,82.25 83,61 arc-90 82,60 75,60 arc-90 74,61
  pour Bottom: 82,60 arc90 83,61
  pour Bottom (no thermals): 83,82.25 arc90 82,83.25 75,83.25 arc90 74,82.25 74,61 arc90 75,60 82,60 arc90 83,61
CSEN_L1  (via drill 0.3 pad 0.6, 0.5 pad 1)
  Top 0.406: U102.5 v55.17,55 | v29,55 29,61
  Route2 0.406: v55.17,55 v29,55
  Bottom 0.203: R109.2 26.75,60.75 25.75,59.75 25.75,54.5 26.13,54.11 U104.3
  other vias: 33,78 33,74 33,70 33,66 33,62 29,82 29,62
  pour Bottom (no thermals): 34.75,83.25 27,83.25 arc90 26,82.25 26,61 arc90 27,60 34.75,60 arc90 35.75,61 35.75,82.25 arc90
  pour Top (isolate 0.4, no thermals): 26,82.25 arc-90 27,83.25 34.75,83.25 arc-90 35.75,82.25 35.75,76.5 arc90 36.75,75.5 56.5,75.5 arc-90 57.5,74.5 57.5,67 arc-90 56.5,66 36.75,66 arc90 35.75,65 35.75,61 arc-90 34.75,60 27,60 arc-90 26,61
  pour Route2 (no thermals): 26,82.25 arc-90 27,83.25 34.75,83.25 arc-90 35.75,82.25 35.75,61 arc-90 34.75,60 27,60 arc-90 26,61
  pour Route15 (no thermals): 26,82.25 arc-90 27,83.25 34.75,83.25 arc-90 35.75,82.25 35.75,61 arc-90 34.75,60 27,60 arc-90 26,61
CSEN_L2  (via drill 0.3 pad 0.6, 0.5 pad 1)
  Top 0.406: U202.5 v113.17,55 | v87,55 87,61
  Route2 0.406: v113.17,55 v87,55
  Bottom 0.203: R207.2 84.75,60.5 84.5,60.5 83.75,59.75 83.75,54.5 84.14,54.11 U204.3
  other vias: 91,78 91,74 91,70 91,66 91,62 87,62 87,82
  pour Bottom (no thermals): 92.75,83.25 85,83.25 arc90 84,82.25 84,61 arc90 85,60 92.75,60 arc90 93.75,61 93.75,82.25 arc90
  pour Top (isolate 0.4, no thermals): 84,82.25 arc-90 85,83.25 92.75,83.25 arc-90 93.75,82.25 93.75,76.5 arc90 94.75,75.5 118.5,75.5 arc-90 119.5,74.5 119.5,67 arc-90 118.5,66 94.75,66 arc90 93.75,65 93.75,61 arc-90 92.75,60 85,60 arc-90 84,61
DUT+  (via drill 0.5 pad 1)  (1 unrouted)
  other vias: 30,94.5 38,98.5 34,98.5 30,90.5 34,94.5 34,90.5 34,86.5 38,86.5 42,86.5 46,86.5 30,98.5 46,90.5 46,94.5 46,98.5 42,98.5 30,86.5 50,86.5 50,90.5 50,94.5 50,98.5 26,86.5 26,94.5 26,98.5 38,90.5 38,94.5 42,94.5 42,90.5 54,86.5 54,90.5 54,94.5 54,98.5 84,86.5 84,94.5 84,98.5 88,98.5 88,94.5 88,90.5 88,86.5 92,86.5 92,90.5 92,94.5 92,98.5 96,98.5 96,94.5 96,90.5 96,86.5 100,86.5 100,90.5 100,94.5 100,98.5 104,98.5 104,94.5 104,90.5 104,86.5 108,86.5 108,90.5 108,94.5 108,98.5 112,98.5 112,94.5 112,90.5
  pour Top (no thermals): 24,98.25 arc-90 25,99.25 54,99.25 arc-90 55,98.25 55,86.75 arc-90 54,85.75 45,85.75 arc90 41.75,82.5 41.75,80.75 arc-90 40,79 arc-90 38.25,80.75 38.25,82.5 arc90 35,85.75 25,85.75 arc-90 24,86.75
  pour Route15 (no thermals): 55,98.25 arc90 54,99.25 25,99.25 arc90 24,98.25 24,86.75 arc90 25,85.75 35,85.75 arc-90 38.25,82.5 38.25,80.75 arc90 40,79 arc90 41.75,80.75 41.75,82.5 arc-90 45,85.75 54,85.75 arc90 55,86.75
  pour Top (no thermals): 82,98.25 arc-90 83,99.25 112,99.25 arc-90 113,98.25 113,86.75 arc-90 112,85.75 103,85.75 arc90 99.75,82.5 99.75,80.75 arc-90 98,79 arc-90 96.25,80.75 96.25,82.5 arc90 93,85.75 83,85.75 arc-90 82,86.75
  pour Bottom (no thermals): 113,98.25 arc90 112,99.25 83,99.25 arc90 82,98.25 82,86.75 arc90 83,85.75 93,85.75 arc-90 96.25,82.5 96.25,80.75 arc90 98,79 arc90 99.75,80.75 99.75,82.5 arc-90 103,85.75 112,85.75 arc90 113,86.75
  pour Bottom (no thermals): 55,98.25 arc90 54,99.25 25,99.25 arc90 24,98.25 24,86.75 arc90 25,85.75 35,85.75 arc-90 38.25,82.5 38.25,80.75 arc90 40,79 arc90 41.75,80.75 41.75,82.5 arc-90 45,85.75 54,85.75 arc90 55,86.75
  pour Route2 (no thermals): 55,98.25 arc90 54,99.25 25,99.25 arc90 24,98.25 24,86.75 arc90 25,85.75 35,85.75 arc-90 38.25,82.5 38.25,80.75 arc90 40,79 arc90 41.75,80.75 41.75,82.5 arc-90 45,85.75 54,85.75 arc90 55,86.75
DUT-  (via drill 0.5 pad 1)  (1 unrouted)
  other vias: 6.5,82 6.5,78 6.5,74 6.5,70 6.5,66 6.5,62 2.5,62 2.5,66 2.5,70 2.5,74 2.5,78 2.5,82 6.5,86.5 2.5,86.5 10.5,86.5 14.5,86.5 2.5,90.5 2.5,94.5 2.5,98.5 6.5,98.5 10.5,98.5 14.5,98.5 14.5,94.5 14.5,90.5 18.5,90.5 18.5,86.5 6.5,90.5 10.5,90.5 10.5,94.5 6.5,94.5 76.5,86.5 76.5,90.5 72.5,90.5 72.5,94.5 72.5,98.5 72.5,86.5 68.5,86.5 68.5,90.5 68.5,94.5 68.5,98.5 64.5,98.5 60.5,98.5 60.5,94.5 60.5,90.5 60.5,86.5 64.5,86.5 64.5,90.5 64.5,94.5 60.5,82 64.5,82 60.5,78 64.5,78 64.5,74 60.5,74 60.5,70 64.5,70 64.5,66 60.5,66 60.5,62 64.5,62
  pour Route2 (no thermals): 0.75,98.25 0.75,61 arc90 1.75,60 14,60 arc90 15,61 15,82.25 arc-90 17,84.25 19,84.25 arc90 20,85.25 20,98.25 arc90 19,99.25 1.75,99.25 arc90
  pour Top (no thermals): 0.75,98.25 0.75,61 arc90 1.75,60 14,60 arc90 15,61 15,82.25 arc-90 17,84.25 19,84.25 arc90 20,85.25 20,98.25 arc90 19,99.25 1.75,99.25 arc90
  pour Route15 (no thermals): 0.75,98.25 0.75,61 arc90 1.75,60 14,60 arc90 15,61 15,82.25 arc-90 17,84.25 19,84.25 arc90 20,85.25 20,98.25 arc90 19,99.25 1.75,99.25 arc90
  pour Bottom (no thermals): 0.75,98.25 0.75,61 arc90 1.75,60 14,60 arc90 15,61 15,82.25 arc-90 17,84.25 19,84.25 arc90 20,85.25 20,98.25 arc90 19,99.25 1.75,99.25 arc90
  pour Top (no thermals): 58.75,98.25 58.75,61 arc90 59.75,60 72,60 arc90 73,61 73,82.25 arc-90 75,84.25 77,84.25 arc90 78,85.25 78,98.25 arc90 77,99.25 59.75,99.25 arc90
  pour Bottom (no thermals): 58.75,98.25 58.75,61 arc90 59.75,60 72,60 arc90 73,61 73,82.25 arc-90 75,84.25 77,84.25 arc90 78,85.25 78,98.25 arc90 77,99.25 59.75,99.25 arc90
GND  (via drill 0.3 pad 0.6)
  Top 0.203: R303.2 v56.5,18
  Top 0.406: C108.2 35.6,41 U103.2 33,41 | 33,41 30.4,41 C109.2 v29,43.75 | U405.3 113.36,23.12 v114,23.75 114.64,23.12 U405.2 U405.1 | v37,43.75 C108.2 | v57.72,38 U101.11 | U101.5 50.09,35.38 v49.46,34.75 48.83,35.38 U101.4 | C108.2 v38.5,42.4 | C112.2 33,43.05 33,41 | v115.72,38 U201.11 | C210.2 93.6,41 U203.2 91,41 | 91,41 88.4,41 C211.2 v87,43.75 | v95,43.75 C210.2 | C210.2 v96.5,42.4 | D304.1 v7.75,35.05 | C313.2 66.6,25 64.5,25 | 64.5,25 U302.2 62.4,25 C312.2 | C314.2 64.5,22.95 64.5,25 | C312.2 v61,22.25 | v59.5,23.6 C312.2 | SJ301.1 v67.5,57 | U102.2 52.63,50.64 v52.27,51 | C119.2 17.41,50.36 v17.41,51 17.41,51.64 C120.2 | C116.2 27.41,50.36 v27.41,51 27.41,51.64 C117.2 | C220.2 75.41,51.64 v75.41,51 75.41,50.36 C219.2 | C115.2 21.41,41 v22.41,42 21.98,42.43 C114.2 | C215.2 79.41,41 v80.41,42 79.97,42.43 C214.2 | C216.2 85.41,50.36 v85.41,51 85.41,51.64 C217.2 | C212.2 91,43.12 91,41 | U202.2 110.64,50.14 v109.77,51 | U304.5 v8,32.91 | U305.4 v7,39.09 | v78.76,26.25 C414.2 78.76,24.24 79.91,23.09 U404.5 | U401.5 88.91,23.09 87.76,24.24 C402.2 v87.76,26.25 | U402.5 97.91,23.09 96.76,24.24 C404.2 v96.75,26.25 | U403.5 106.91,23.09 105.76,24.24 C410.2 v105.76,26.25 | C417.2 74.24,24.74 v73.5,24 | C418.2 81.76,24.74 v82.5,24 83.24,24.74 C405.2 | C406.2 90.76,24.74 v91.5,24 92.24,24.74 C407.2 | C408.2 99.76,24.74 v100.5,24 101.24,24.74 C411.2 | C412.2 108.76,24.74 v109.5,24 | U201.4 106.83,35.63 v107.46,35 108.09,35.63 U201.5 | Q409.3 115,26.02 v115,27 | C317.2 v54,23 | v54,21 52.1,21 C317.2 | v54,25 52.1,25 C317.2 | v32.75,24 32.75,23.01 C302.2 | C306.2 25.25,24.99 v25.25,24 | v19.75,15 21.2,16.45 L302.2 21,17 | v19.75,17 21,17
  Top 0.406: v19.75,19 21,17.75 21,17 | C305.1 v32.17,6.76 C304.1 | C309.2 v25.82,6.76 C310.2 | v29,18.75 C303.2 v29,16.25
  Top 0.508: R314.1 2.69,41.69 v2,41 2.74,40.26 C323.2
  Bottom 0.406: Q210.3 v99.1,65 | v96.9,63 Q209.2 | v101,62 C213.2 | D201.1 v84.45,41.25 | D202.1 v74.45,41.25 | Q110.3 v41.02,65 | v38.98,63 Q109.2 | v44.24,63.25 C113.2 | D101.1 v26.45,41.25 | D102.1 v16.45,41.25 | C111.1 50.36,69.5 50.25,69.39 v50.25,70.5 50.24,70.51 C107.2 | C110.1 52.51,50.76 v52.27,51 52.51,51.24 C106.2 | U106.5 v17.41,51 | U104.5 v27.41,51 | U206.5 v75.41,51 | U105.4 v22.41,42 | C118.2 21.24,46.26 v20.5,47 19.76,46.26 C121.2 | C221.2 77.76,46.26 v78.5,47 79.24,46.26 C218.2 | U205.4 v80.41,42 | U204.5 v85.41,51 | C204.2 108.25,71.49 v108.25,70.5 108.24,70.49 C209.1 | C208.1 110.51,50.26 v109.77,51 110.51,51.74 C203.2 | C321.2 7.64,33.26 v8,32.91 8.36,33.26 C322.2 | v78.76,26.25 C414.2 | C402.2 v87.76,26.25 | C410.2 v105.76,26.25 | C404.2 v96.75,26.25 | C301.2 v32.75,24 | C307.1 v25.25,24 | v30.91,9.75 U301.14 30.91,13.09 30.26,13.74 30.26,14.99 v29,16.25 27.74,14.99 27.74,13.74 27.09,13.09 U301.11 v27.09,9.75 | U301.2 v32.17,6.76 | C307.1 v29,24 C301.2 | C307.1 27.1,24.1 v29,26 30.9,24.1 C301.2 | C301.2 30.9,23.9 v29,22 | C307.1 27.1,23.9 v29,22 | v29,18.75 v29,22 | C105.2 v48.75,43 | C101.2 v49.75,40.5 | C102.2 v49.75,38 | C207.2 v106.75,43 | C205.2 v107.75,40.5 | C206.2 v107.75,38 | v23.75,8.5 22.02,8.5 C308.2
  Bottom 0.508: C320.2 8,40.09 v7,39.09 5.93,39.09 C319.2
  other vias: 42.5,14.75 41.5,14.75 41,10 42.5,10 44,4 44,6 44,8 40.25,16.5 40.25,15.5
  pour Route15 (rank 2): -1,58.5 37.25,58.5 37.25,69 57.5,69 57.5,58.5 95.25,58.5 95.25,64 121,64 121,0 -1,0
  pour Route15: 35.25,58.5 arc90 37.25,60.5 37.25,74.5 arc-90 38.25,75.5 43.25,75.5 arc90 44.25,76.5 44.25,82.25 arc-90 45.25,83.25 56.5,83.25 arc-90 57.5,82.25 57.5,60.5 arc90 59.5,58.5 63,58.5 arc-90 64,57.5 64,56 arc-90 63,55 32,55 arc-90 31,56 31,57.5 arc-90 32,58.5
  pour Route15: 93.25,58.5 arc90 95.25,60.5 95.25,74.5 arc-90 96.25,75.5 101.25,75.5 arc90 102.25,76.5 102.25,82.25 arc-90 103.25,83.25 118.5,83.25 arc-90 119.5,82.25 119.5,56 arc-90 118.5,55 90,55 arc-90 89,56 89,57.5 arc-90 90,58.5
  pour Top (rank 3): 50,0.75 39.75,0.75 39.75,17 43,17 43,11.5 47,11.5 47,14 50,14
GNDI  (via drill 0.3 pad 0.6)
  Top 0.406: U403.3 105.64,16.88 v105,16.25 104.36,16.88 U403.2 | U402.3 96.64,16.88 v96,16.25 95.36,16.88 U402.2 | U401.3 87.64,16.88 v87,16.25 86.36,16.88 U401.2 | U404.3 78.63,16.88 v78,16.25 77.37,16.88 U404.2 | v74.47,9.75 Q407.3 | v78.97,9.75 Q408.3 | v83.47,9.75 Q401.3 | v87.97,9.75 Q402.3 | v92.47,9.75 Q403.3 | v96.97,9.75 Q404.3 | v101.47,9.75 Q405.3 | v105.97,9.75 Q406.3 | C416.2 C415.2 | v113.15,11.75 C415.2 | C415.2 v112,13 | C419.2 v110,10.5 | C416.2 114.64,16.4 U405.7 | C416.2 112.09,16.14 U405.5
  pour Route15: 118.25,0.75 73.25,0.75 arc-90 72.25,1.75 72.25,17.75 arc-90 73.25,18.75 118.25,18.75 arc-90 119.25,17.75 119.25,1.75 arc-90
HIGHC1
  Bottom 0.406: R123.2 C121.1 19.87,44.37 U105.2
HIGHC2
  Bottom 0.406: U205.2 77.87,44.37 C221.1 R223.2
LATCH_DAC  (via drill 0.3 pad 0.6)
  Top 0.203: U402.6 96.64,21.37 96.75,21.25 98.5,21.25 98.75,21.5 98.75,24.49 C408.1 | U201.7 v110.64,34 v110.64,31 | U101.7 v52.63,34.75 | v98.24,26.25 v98.24,31
  Top 0.406: C408.1 v98.24,26.25
  Route2 0.203: v52.63,34.75 53.38,34 v110.64,34 | v98.24,31 v110.64,31
  Bottom 0.406: R408.1 98.24,25.05 v98.24,26.25
LATCH_DAC_I
  Top 0.203: JP301.4 102.35,6.72 Q404.1
LGATE_1
  pour Bottom: 44.25,76 44.25,82.25 arc-90 45.25,83.25 56.5,83.25 arc-90 57.5,82.25 57.5,76 arc-90 56.5,75 45.25,75 arc-90
LGATE_2
  pour Bottom: 102.25,76 102.25,82.25 arc-90 103.25,83.25 118.25,83.25 arc-90 119.25,82.25 119.25,76 arc-90 118.25,75 103.25,75 arc-90
LOWC1
  Bottom 0.406: R121.2 C118.1 21.13,44.37 U105.3
LOWC2
  Bottom 0.406: U205.3 79.13,44.37 C218.1 R221.2
MISO  (via drill 0.3 pad 0.6)
  Top 0.203: Q409.1 112.92,27 v111.76,27 v111.76,30.5 | U305.6 v12.45,40.36
  Route2 0.203: v111.76,30.5 v79.13,30.5 v21.13,30.5 21.13,35.12 20.75,35.5 12.75,35.5 12.45,35.8 v12.45,40.36
  Bottom 0.203: U205.6 v79.13,30.5 | U105.6 v21.13,30.5 | R417.1 111.76,25.05 v111.76,27
MISO_I
  Top 0.203: U405.6 113.36,18.63 113.25,18.75 111.5,18.75 111.25,18.5 111.25,12.1 C419.1 R419.1 112.81,6.84 JP301.1
MOSI  (via drill 0.3 pad 0.6)
  Top 0.203: v113.17,32.5 U201.9 v113.17,38.5 | U403.6 105.64,21.37 105.75,21.25 107.5,21.25 107.75,21.5 107.75,24.49 C412.1 v107.24,26.25 v107.24,32.5 | v22.41,36.5 20.15,36.5 20.09,36.55 19.64,36.55 19.58,36.5 12.25,36.5 12,36.75 12,38.75 11.66,39.09 U305.5
  Route2 0.203: v107.24,32.5 v113.17,32.5 | v113.17,38.5 109.5,38.5 108.5,37.5 81.41,37.5 v80.41,36.5 v22.41,36.5
  Bottom 0.203: U105.5 v22.41,36.5 | v107.24,26.25 107.24,25.05 R412.1 | U205.5 v80.41,36.5
MOSI_I
  Top 0.203: JP301.2 107.43,9.46 Q406.1
N$1
  Bottom 0.406: Q102.2 54.81,67.11 R101.1 54.81,69.89 Q101.1
N$2
  Top 0.406: U102.1 51.37,49.91 51.09,50.19 R104.2
N$3  (via drill 0.3 pad 0.6)
  Top 0.406: U101.21 v48.83,47.25
  Bottom 0.406: C103.2 48.83,46.06 v48.83,47.25
N$4  (via drill 0.3 pad 0.6)
  Top 0.406: U101.20 v50.09,47.25
  Bottom 0.406: C104.2 47.76,47.76 48,48 49.34,48 v50.09,47.25
N$5
  Bottom 0.305: R108.1 41.5,59.75 41.02,60.22 Q109.3 41.02,63.22 | Q110.1 39.2,65.05 41.02,63.22 | Q106.1 42.85,65.05 41.02,63.22
N$6
  Top 0.406: U102.8 51.37,52.09 51.09,51.81 R104.1
N$7
  Bottom 0.406: U106.6 16.14,46.95 R123.1 15.5,45.69 D102.3
N$8
  Bottom 0.203: 39.01,60 Q109.1
  Bottom 0.305: R107.1 42.69,58.75 39.19,58.75 | R111.2 39.19,58.75 | 39.19,58.75 39.19,59.83 39.01,60
N$9
  Top 0.406: U101.17 U102.3
N$10
  Top 0.406: C112.1 31.75,43.51 U103.4
N$11
  Bottom 0.406: Q104.2 47,69.92 R105.1
N$12
  Bottom 0.406: Q202.2 112.97,68.34 R201.1 112.97,68.66 Q201.1
N$13
  Bottom 0.406: Q101.2 52.9,74.03 R102.2
N$14
  Bottom 0.406: Q204.2 106,68.92 R205.1
N$15
  Bottom 0.406: Q201.2 110.89,74.03 R203.2
N$16
  Bottom 0.406: U104.6 26.13,46.32 R121.1 25.5,45.69 D101.3
N$17
  Top 0.203: C311.1 55.26,11.89 U303.1
N$18
  Top 0.203: U405.4 112.09,24.72 R418.1 111.86,25.05 Q409.2
N$19
  Top 0.203: C311.2 53.74,13.99 53.75,14 53.12,14.63 U303.6
  pour Top: 43.25,15.75 arc-90 43.5,16 49.5,16 49.5,15.5 50.25,15.5 arc-90 50.5,15.25 50.5,14 arc-90 50.25,13.75 48.25,13.75 arc90 48,13.5 48,12.25 arc-90 47.75,12 43.5,12 arc-90 43.25,12.25
N$20
  Top 0.203: R304.2 R303.1 53.69,16.31 54.09,15.91 U303.4
N$21
  Top 0.203: U403.1 103.09,14.76 R409.1 103.6,14.25 Q405.2
N$22
  Top 0.203: U403.4 106.91,15.26 R410.1 106.15,12.85 107.05,11.95 Q406.2
N$23
  Top 0.406: D304.3 3.31,36 R312.1 3,32.5 3.87,31.63 U304.6
N$24
  Top 0.406: R306.1 R308.2
N$25
  Bottom 0.203: Q210.1 97.95,65.05 99.1,63.9 | 99.1,63.9 Q209.3 99.1,60.15 99.75,59.5 R213.1 | Q208.1 100.25,65.05 99.1,63.9
N$26
  Top 0.406: R305.2 R306.2
N$27
  Top 0.406: R307.2 R305.1
N$28
  Top 0.406: R314.2 3.69,43.31 4,43 4,42 4.37,41.64 U305.2
N$29
  Top 0.406: R308.1 16,27.47 16,33.5 15.5,34 14,34 13.08,33.08 13.08,32.33
  Top 0.508: R310.2 13.08,32.33 12.38,31.63 U304.3
N$30
  Top 0.406: C323.1 3.74,38.74 4,39 4,40 4.37,40.36 U305.3
  Top 0.508: C323.1 R312.2
N$31
  Bottom 0.203: 97.15,58.5 R216.2 | 97.15,58.5 97.15,59.8 Q209.1 | R212.1 100.65,58.5 97.15,58.5
N$32
  Bottom 0.203: R115.2 15.75,58.56 15.75,72 17.14,73.39 R117.E2
N$33
  Top 0.406: R309.2 arc90 14,5.53 R307.1
N$34
  Bottom 0.203: R114.1 R115.1 16.14,55.82 U106.3
N$35
  Bottom 0.203: R118.1 14.75,60.06 14.75,69.5 13.63,70.61 R116.E2
N$36
  Top 0.508: R313.2 13.08,29.67 12.38,30.37 U304.2
N$37
  Bottom 0.203: R118.2 R119.2 14.87,55.82 U106.2
N$38
  Bottom 0.203: R119.1 15.25,58.56 15.25,72 13.87,73.39 R117.E1
N$39
  Bottom 0.203: R214.E1 75.37,70.61 74.25,69.5 74.25,60.06 R210.1
N$40
  Bottom 0.203: R114.2 16.25,60.06 16.25,69.5 17.36,70.61 R116.E1
N$41  (via drill 0.3 pad 0.6)
  Top 0.406: U201.21 v106.83,47.25
  Bottom 0.406: C201.2 106.83,46.06 v106.83,47.25
N$42  (via drill 0.3 pad 0.6)
  Top 0.406: U201.20 v108.09,47.25
  Bottom 0.406: C202.2 105.76,47.76 106,48 107.34,48 v108.09,47.25
N$43  (via drill 0.3 pad 0.6)
  Top 0.406: v111.91,60.05 U202.6
  Bottom 0.406: Q203.1 v111.91,60.05 112.97,61.12 Q202.1
N$44
  Bottom 0.406: Q203.2 107.97,63.34 R206.2 107.97,63.66 Q204.1
N$45  (via drill 0.3 pad 0.6)
  Top 0.406: U201.3 v105.56,34.75
  Bottom 0.406: R202.1 105.56,35.26 v105.56,34.75
N$46
  Bottom 0.203: R211.1 73.75,58.56 73.75,72 75.13,73.39 R215.E2
N$47
  Top 0.203: U401.1 85.09,14.76 R401.1 85.6,14.25 Q401.2
N$48
  Top 0.203: U401.4 88.91,15.26 R402.1 88.15,12.85 89.05,11.95 Q402.2
N$49
  Top 0.406: R204.2 109.08,50.19 109.36,49.91 U202.1
N$50
  Top 0.406: R204.1 109.08,51.81 109.36,52.09 U202.8
N$51
  Top 0.406: U201.17 U202.3
N$52
  Bottom 0.203: R218.2 73.25,58.56 73.25,72 71.87,73.39 R215.E1
N$53
  Bottom 0.203: R214.E2 71.63,70.61 72.75,69.5 72.75,60.06 R219.2
N$54
  Bottom 0.203: R210.2 R211.2 74.13,55.82 U206.3
N$55  (via drill 0.3 pad 0.6)
  Top 0.406: C310.1 v24.55,4.25
  Bottom 0.406: U301.8 24.55,4.24 v24.55,4.25
N$56
  Bottom 0.406: U206.6 74.13,46.95 R223.1 73.5,45.69 D202.3
N$57
  Bottom 0.406: U204.6 84.14,46.32 R221.1 83.5,45.69 D201.3
N$58
  Top 0.203: U402.1 94.09,14.76 R405.1 94.6,14.25 Q403.2
N$59
  Top 0.203: U402.4 97.91,15.26 R406.1 97.15,12.85 98.05,11.95 Q404.2
N$60  (via drill 0.3 pad 0.6)
  Top 0.406: U101.3 v47.55,34.75
  Bottom 0.406: R103.1 47.55,35.26 v47.55,34.75
N$61  (via drill 0.3 pad 0.6)
  Top 0.406: C309.1 26.81,5.24 v25.82,4.25
  Bottom 0.406: U301.7 v25.82,4.25
N$62
  Top 0.406: C212.1 89.75,43.51 U203.4
N$63
  Bottom 0.203: R218.1 72.62,56.07 72.62,56 | R219.1 72.43,56.19 72.62,56 | 72.62,56 72.87,55.75 U206.2
N$64  (via drill 0.3 pad 0.6)
  Top 0.406: C304.2 33.45,4.69 v33.45,4.25
  Bottom 0.406: U301.1 v33.45,4.25
N$65  (via drill 0.3 pad 0.6)
  Top 0.406: L301.2 v34.5,17 | v34.5,15 33.2,16.3 L301.2 | v34.5,19 33.2,17.7 L301.2
  Bottom 0.406: U301.15 32.17,14.98 D301.2 32.81,15 v34.5,15 v34.5,17 v34.5,19
N$66
  Top 0.406: C314.1 65.75,22.49 U302.4
N$67  (via drill 0.3 pad 0.6)
  Top 0.406: U102.6 v53.91,60.05
  Bottom 0.406: Q103.1 v53.91,60.05 54.98,61.12 Q102.1
N$68
  Bottom 0.406: Q103.2 49.81,62.11 R106.2 49.81,64.89 Q104.1
N$69  (via drill 0.3 pad 0.6)
  Top 0.406: L302.1 v23.5,17 | v23.5,15 24.8,16.3 L302.1 | v23.5,19 24.8,17.7 L302.1
  Bottom 0.406: U301.10 25.82,14.98 D302.1 25.19,15 v23.5,15 v23.5,17 v23.5,19
N$70  (via drill 0.3 pad 0.6)
  Top 0.406: R301.1 v33.75,25 35.98,25 Q301.3
  Bottom 0.203: D301.1 31,17.19 31,13.65 31.46,13.19 31.46,10.29 31.75,10 33,10 33.45,10.45 U301.16
  Bottom 0.406: D301.1 33.81,20 34.5,20 37.1,22.6 C301.1 36.1,25 v33.75,25
N$71
  Top 0.406: R301.2 31.24,24.95 C302.1 32.08,22.16 33.33,22.16 34.14,22.98 Q301.1
N$72  (via drill 0.3 pad 0.6)
  Top 0.406: R302.1 v24.25,23 24.23,22.98 Q302.3
  Bottom 0.203: D302.2 27,17.19 27,13.65 26.54,13.19 26.54,10.29 26.25,10 25,10 24.55,10.45 U301.9
  Bottom 0.406: D302.2 24.19,20 23.5,20 20.9,22.6 C307.2 21.9,23 v24.25,23
N$73
  Top 0.406: R302.2 26.81,24.95 C306.1 25.92,25.84 24.67,25.84 23.86,25.02 Q302.1
N$76
  Top 0.203: U404.1 76.09,14.76 R413.1 76.6,14.25 Q407.2
N$77
  Top 0.203: U404.4 79.91,15.26 R414.1 79.15,12.85 80.05,11.95 Q408.2
RG1_H6
  Top 0.406: R311.2 8.92,28.17 9.84,29.09 U304.1
RG1_L1
  Bottom 0.406: U206.1 71.59,52.59 70.92,51.92 R222.2
RG1_L2
  Bottom 0.406: U204.1 81.59,52.59 80.92,51.92 R220.2
RG1_L3
  Bottom 0.406: U106.1 12.55,53.47 R122.2
RG1_L4
  Bottom 0.406: U104.1 22.55,53.47 R120.2
RG2_H6
  Top 0.406: R311.1 7.08,28.17 6.15,29.09 U304.8
RG2_L1
  Bottom 0.406: U206.8 71.59,49.41 70.92,50.08 R222.1
RG2_L2
  Bottom 0.406: U204.8 81.59,49.41 80.92,50.08 R220.1
RG2_L3
  Bottom 0.406: U106.8 12.55,48.53 R122.1
RG2_L4
  Bottom 0.406: U104.8 22.55,48.53 R120.1
SCK  (via drill 0.3 pad 0.6)
  Top 0.203: v102.76,26.25 v102.76,31.5 | v111.91,31.5 U201.8 v111.91,38 | U403.7 104.36,21.37 104.25,21.25 102.5,21.25 102.25,21.5 102.25,24.49 C411.1 | U101.8 v53.91,34.75 | U305.7 v13,41.64
  Top 0.406: C411.1 v102.76,26.25
  Route2 0.203: v102.76,31.5 v111.91,31.5 | v111.91,38 109.75,38 108.75,37 82,37 81,36 v77.87,36 55.16,36 v53.91,34.75 52.66,36 v19.87,36 13,36 v13,41.64
  Bottom 0.203: U205.7 v77.87,36 | U105.7 v19.87,36
  Bottom 0.406: R411.1 102.76,25.05 v102.76,26.25
SCK_I
  Top 0.203: JP301.3 104.89,8.68 Q405.1
SDO_DAC2  (via drill 0.3 pad 0.6)
  Top 0.203: U201.10 v114.44,39 | U101.9 v55.17,38.5
  Route2 0.203: v114.44,39 55.67,39 v55.17,38.5
VREF1  (via drill 0.3 pad 0.6)
  Top 0.203: U103.3 34.25,42.25 v35,43
  Top 0.406: U103.1 36.48,40.05 C108.1 37.1,39.5 v38.5,39.5 | U101.15 U101.14 v57.72,42.5
  pour Route2: 34,38 34,46 45,46 45,43 59,43 59,38
VREF2  (via drill 0.3 pad 0.6)
  Top 0.203: U203.3 92.25,42.25 v93,43
  Top 0.406: U201.15 U201.14 v115.72,44 | U203.1 94.55,40.05 C210.1 95.03,39.5 v96.5,39.5
  pour Route2: 92,39 92,44 104.5,44 104.5,45 117,45 117,39
VREF_MAX743
  Bottom 0.406: U301.6 27.09,4.91 26.48,5.52 C308.1
VSENSE+
  Top 0.406: PAD301.1 R309.1
VSENSE-
  Top 0.406: R313.1 10.42,25 4,25 1,22 1,13 3,11 PAD302.1
  Top 0.508: R313.1 R310.1